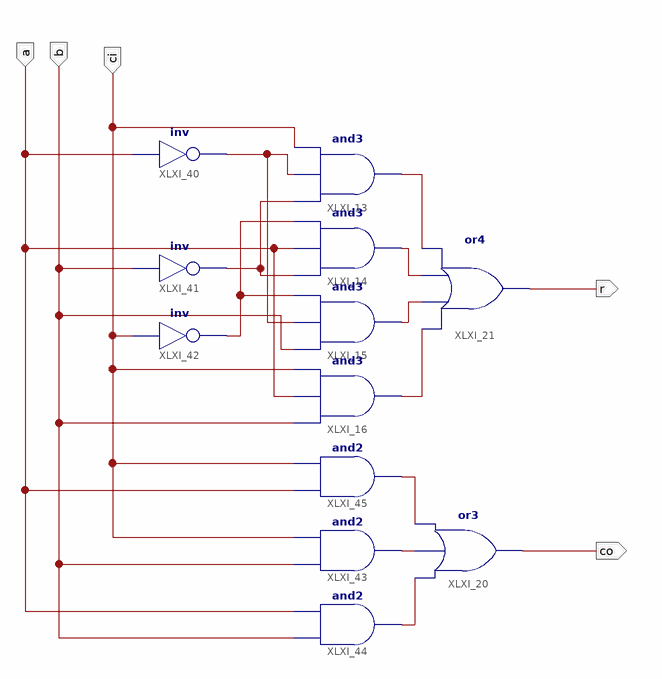
[diagram p0: schematic sheet 1]
// Xilinx ISE schematic add1b.sch (spartan3e) as structural Verilog: 12 symbols, 5 ports
module add1b (
  input  a,
  input  b,
  input  ci,
  output r,
  output co
);

  wire XLXN_1, XLXN_2, XLXN_4, XLXN_5, XLXN_6, XLXN_7, XLXN_12, XLXN_42, XLXN_73, XLXN_75;

  and XLXI_13 (XLXN_1, XLXN_75, XLXN_42, ci);
  and XLXI_14 (XLXN_2, XLXN_75, a, XLXN_73);
  and XLXI_15 (XLXN_12, b, XLXN_42, XLXN_73);
  and XLXI_16 (XLXN_4, b, a, ci);
  or XLXI_20 (co, XLXN_7, XLXN_6, XLXN_5);
  or XLXI_21 (r, XLXN_4, XLXN_12, XLXN_2, XLXN_1);
  not XLXI_40 (XLXN_42, a);
  not XLXI_41 (XLXN_75, b);
  not XLXI_42 (XLXN_73, ci);
  and XLXI_43 (XLXN_6, b, ci);
  and XLXI_44 (XLXN_7, b, a);
  and XLXI_45 (XLXN_5, a, ci);
endmodule
